# EAGLE design flyback (EAGLE 9.6.2)
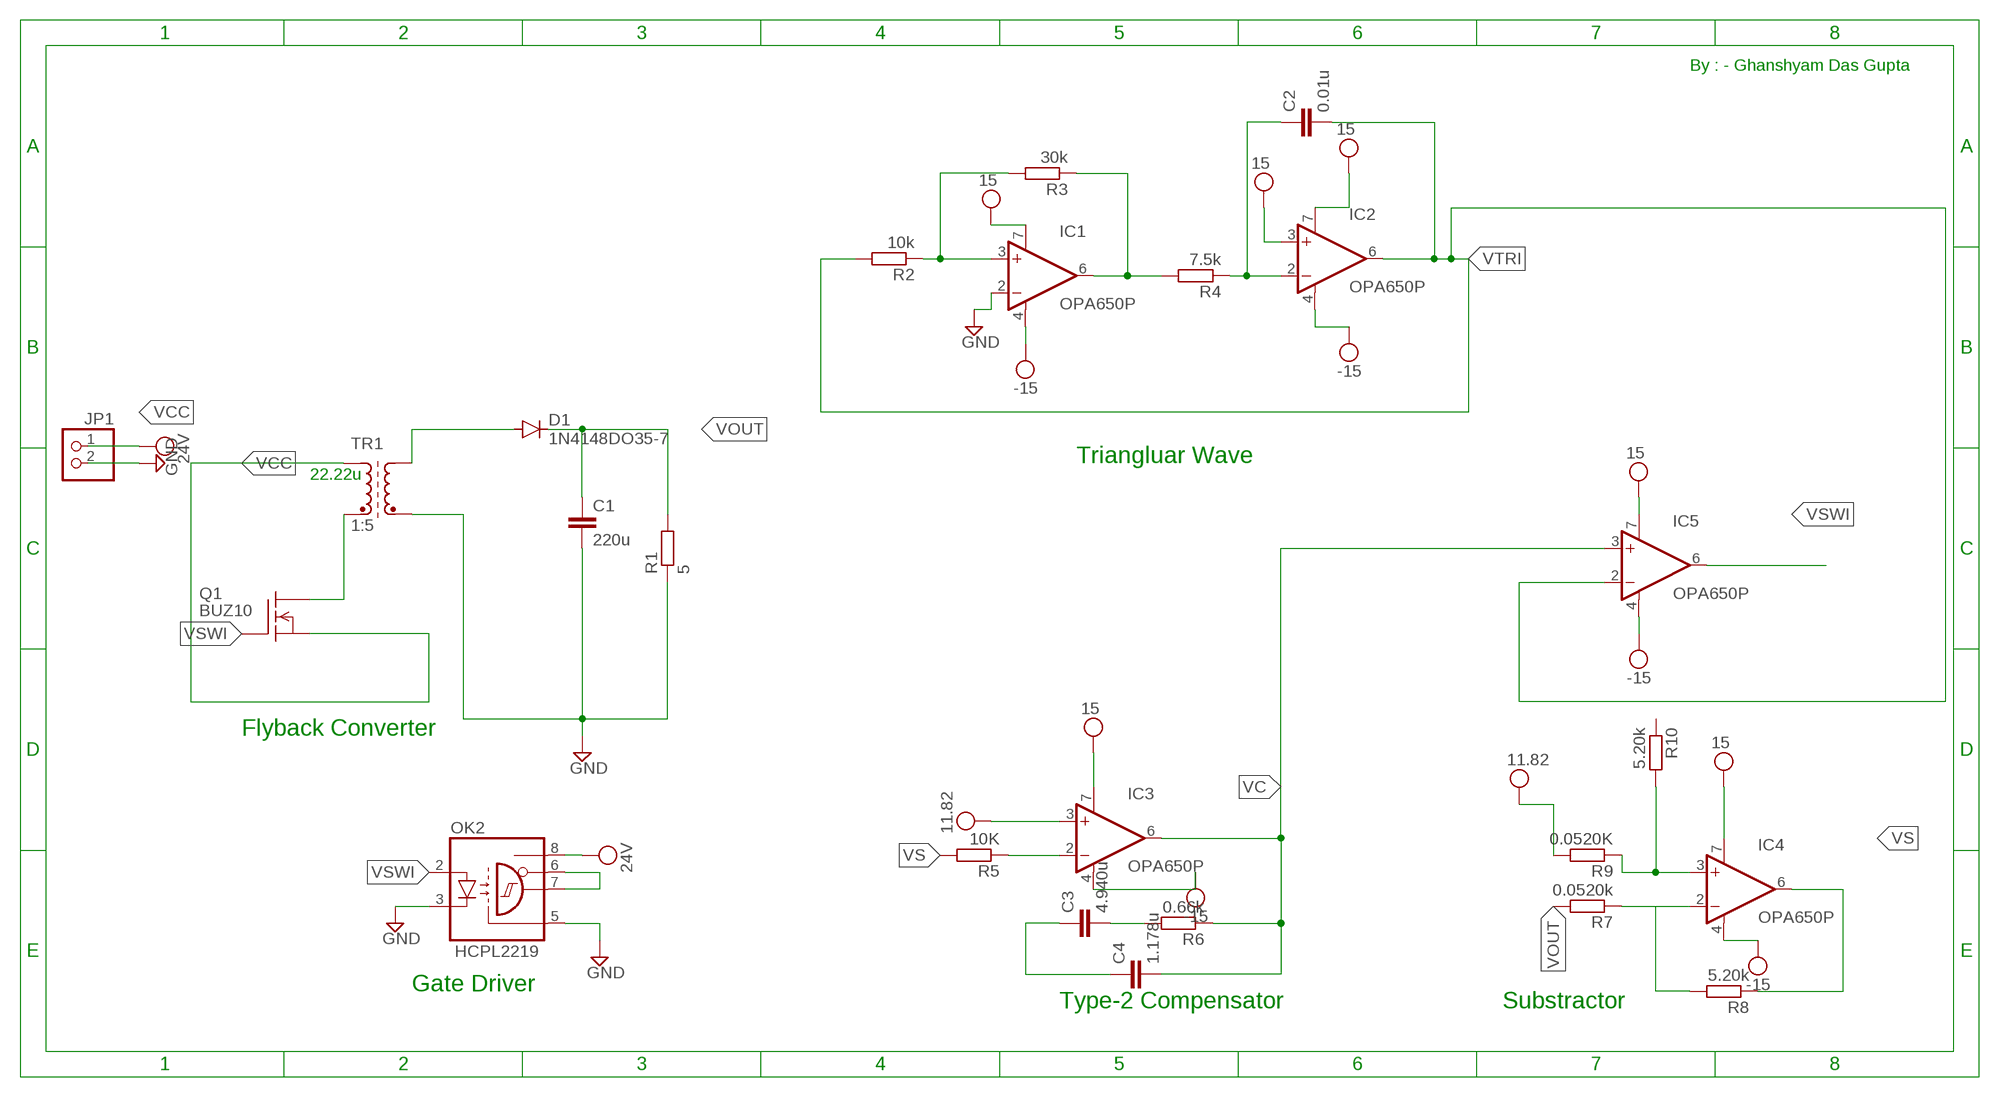
[diagram p0: schematic, sheet 1]

## Parts
C1  220u  C-EU050-050X075  [C050-050X075]
C2  0.01u  C-EU050-050X075  [C050-050X075]
C3  4.940u  C-EU050-050X075  [C050-050X075]
C4  1.178u  C-EU050-050X075  [C050-050X075]
D1  1N4148DO35-7  [DO35-7]
IC1  OPA650P  [DIL08]
IC2  OPA650P  [DIL08]
IC3  OPA650P  [DIL08]
IC4  OPA650P  [DIL08]
IC5  OPA650P  [DIL08]
JP1  PINHD-1X2  [1X02]
OK2  HCPL2219  [DIL08]
Q1  BUZ10  [TO220]
R1  5  R-EU_0414/15  [0414/15]
R2  10k  R-EU_0414/15  [0414/15]
R3  30k  R-EU_0414/15  [0414/15]
R4  7.5k  R-EU_0414/15  [0414/15]
R5  10K  R-EU_0414/15  [0414/15]
R6  0.66k  R-EU_0414/15  [0414/15]
R7  0.0520k  R-EU_0414/15  [0414/15]
R8  5.20k  R-EU_0414/15  [0414/15]
R9  0.0520K  R-EU_0414/15  [0414/15]
R10  5.20k  R-EU_0414/15  [0414/15]
TR1  1:5  SM-T4  [SM-T4]

## Nets
GND: C1.2 IC1.2(-IN) JP1.2 OK2.3(C) OK2.5(GND) R1.1 TR1.4(E2)
N$1: Q1.3(S) TR1.1(A1)
N$2: D1.A TR1.5(A2)
N$3: IC1.3(+IN) R2.1 R3.2
N$4: OK2.6(VE) OK2.7(VO)
N$5: Q1.2(D) TR1.2(E1)
N$6: IC1.6(OUT) R3.1 R4.2
N$7: IC3.2(-IN) R5.1
N$8: C3.2 R6.2
N$9: C2.1 IC2.2(-IN) R4.1
N$12: C3.1 C4.1
N$13: IC4.3(+IN) R9.1 R10.2
N$14: IC4.2(-IN) R7.1 R8.2
VC: C4.2 IC3.6(OUT) IC5.3(+IN) R6.1
VCC: IC1.4(V-) IC1.7(V+) IC2.3(+IN) IC2.4(V-) IC2.7(V+) IC3.3(+IN) IC3.4(V-) IC3.7(V+) IC4.4(V-) IC4.7(V+) IC5.4(V-) IC5.7(V+) JP1.1 OK2.8(VCC) R9.2 ; supply symbol labelled 24V, 15, -15, 11.82
VOUT: C1.1 D1.C R1.2
VS: IC4.6(OUT) R8.1
VSWI: IC5.6(OUT)
VTRI: C2.2 IC2.6(OUT) IC5.2(-IN) R2.2
Unconnected: OK2.2(A) Q1.1(G) R5.2 R7.2 R10.1

## Notes on the sheet
- By : - Ghanshyam Das Gupta
- Triangluar Wave
- 22.22u
- Flyback Converter
- Gate Driver
- Type-2 Compensator | Substractor

## Library data of the parts
C1-C4 = rcl:C-EU: CAPACITOR, European symbol; SPICEPREFIX: C
D1 = diode:1N4148: DIODE high speed (Philips)
IC1-IC5 = burr-brown:OPA650: Operational Amplifier Wideband, Low Power, Voltage Feedback; OC_FARNELL: unknown; OC_NEWARK: unknown
JP1 = pinhead:PINHD-1X2: PIN HEADER
OK2 = optocoupler:HCPL2219: HEWLETT PACKARD OPTO COUPLER; MF: AGILENT TECHNOLOGIES; MPN: HCPL-2219-000E; OC_FARNELL: 9995250; OC_NEWARK: 31K6963
Q1 = transistor-fet:BUZ10: N-Channel Enhancement MOSFET 50V; 20A; 0,080Ohm
R1-R10 = rcl:R-EU_: RESISTOR, European symbol; SPICEPREFIX: R
TR1 = inductor-neosid:SM-T4: TRANSFORMER SMD wideband transformer; OC_FARNELL: unknown; OC_NEWARK: unknown

## Net classes
0 default: width 0.203 mm, drill 0.203 mm, clearance 0.203 mm
1 VCC: width 0.203 mm, drill 0.152 mm, clearance 0.152 mm
2 GND: width 1.219 mm, drill 0.152 mm, clearance 0.152 mm

## Board
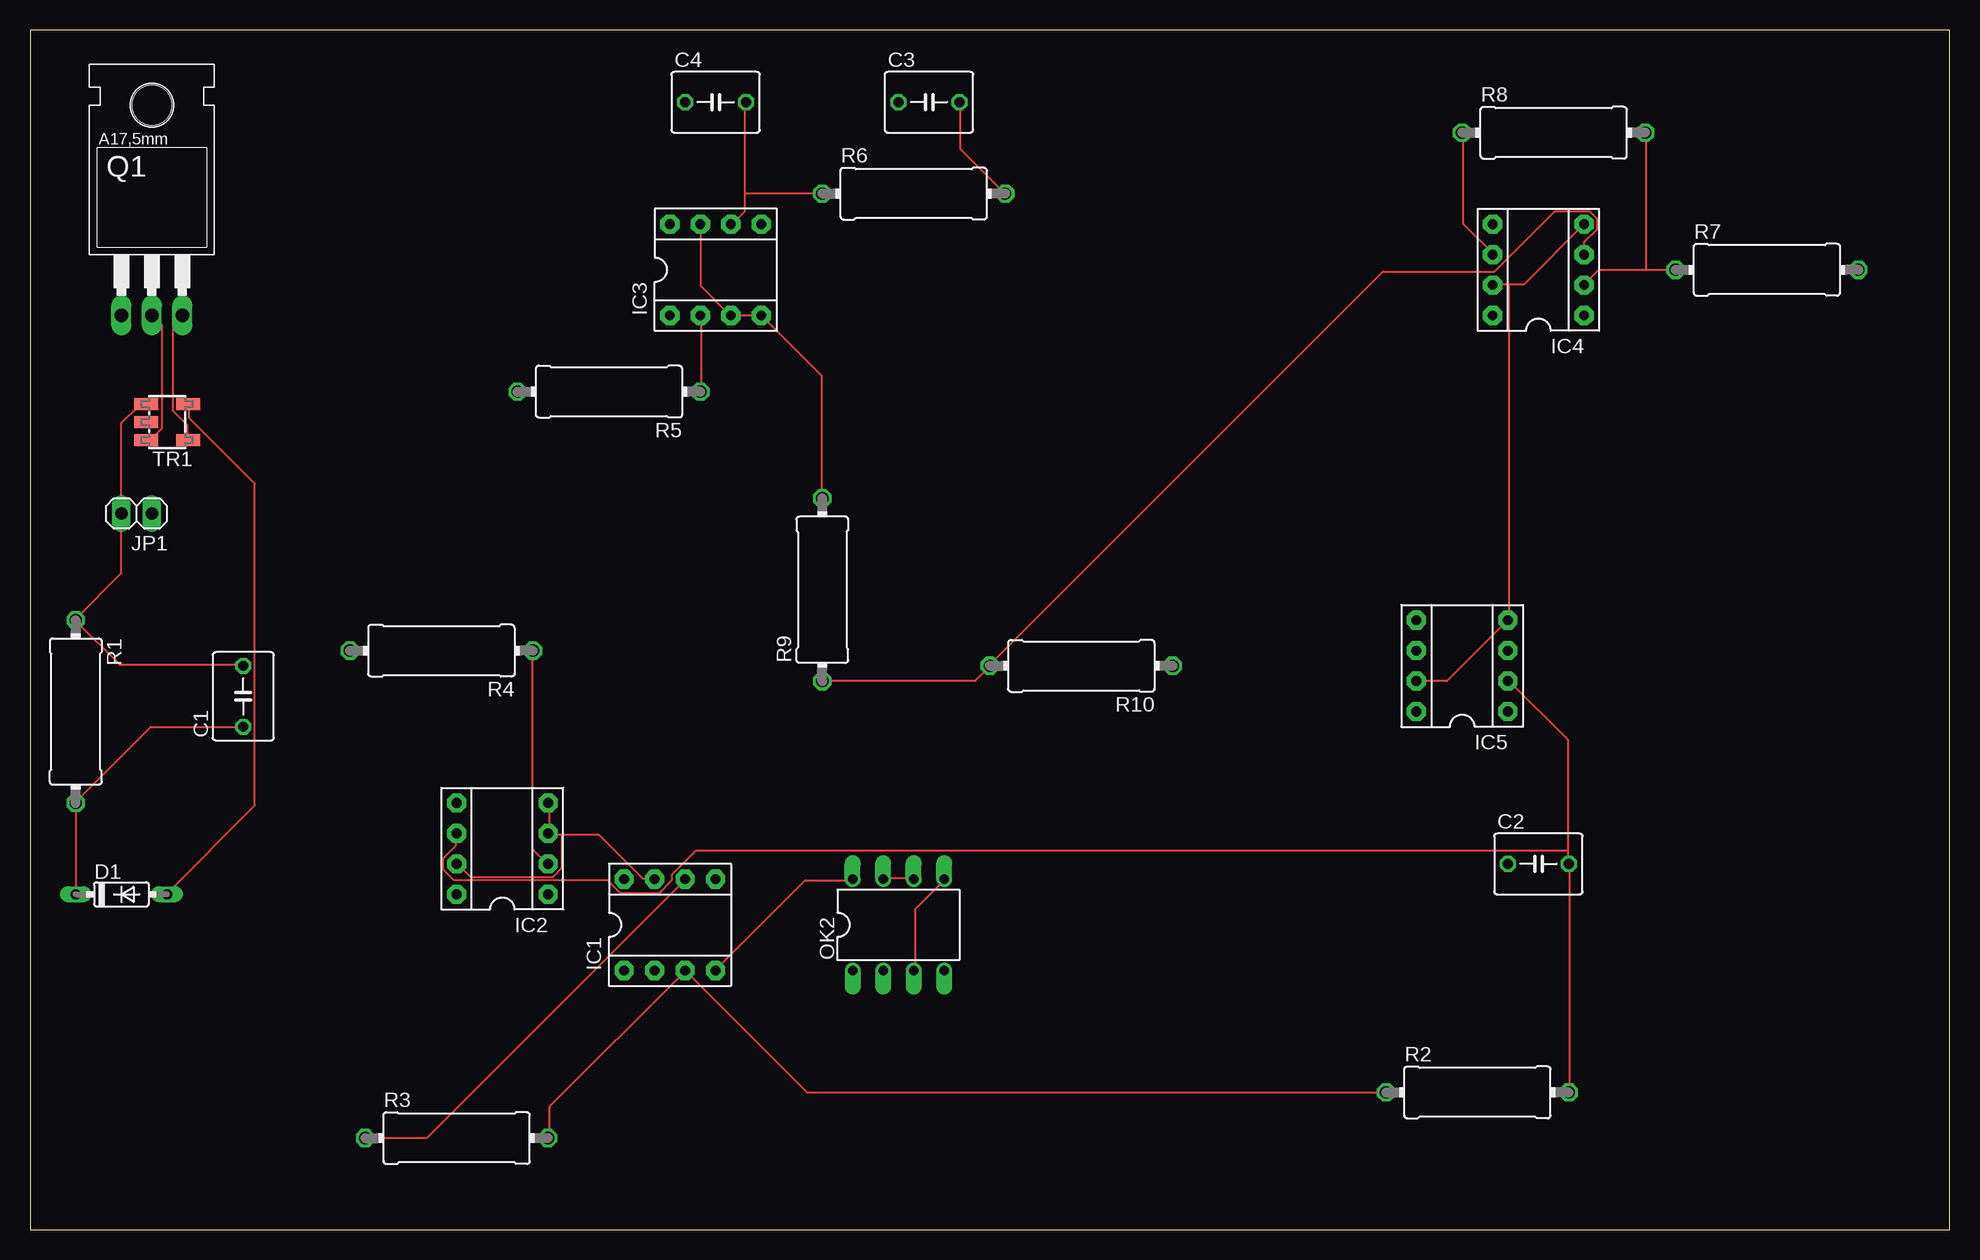
[diagram p1: board, top side]
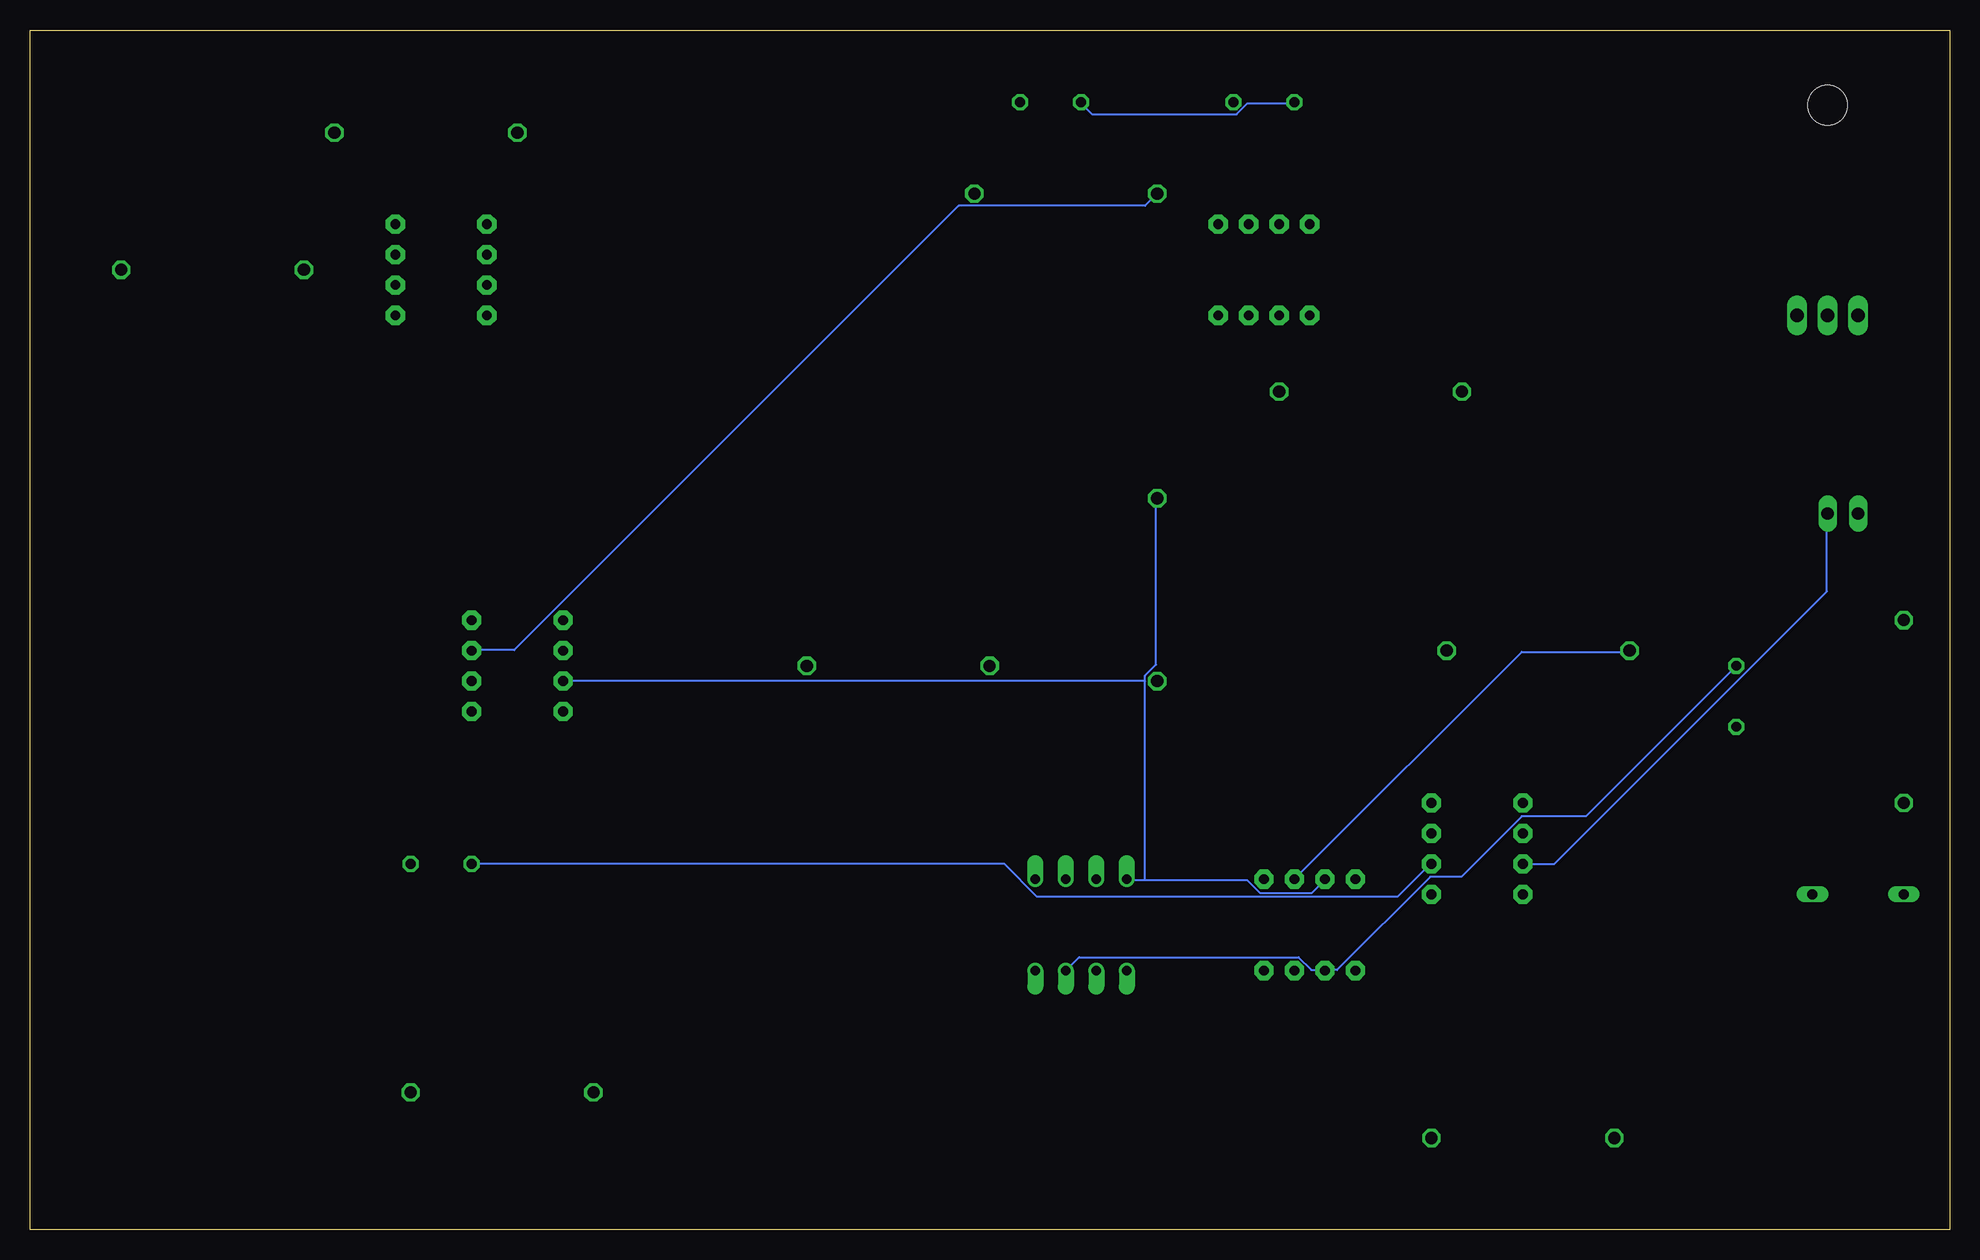
[diagram p2: board, bottom side, seen from below]

Size 160 x 100 mm. Coordinates in mm from the lower left corner, seen from the top.
Outline: 0,0 160,0 160,100 0,100 0,0
Copper layers (1*16): Top 0.035mm / dielectric 1.5mm / Bottom 0.035mm
Design rules "default": minimum track width 6mil, minimum drill 0.35mm, track to track 6mil, track to pad 6mil, pad to pad 6mil, via to via 6mil, smd to smd 6mil, copper to edge 40mil, drill to drill 6mil, minimum pad ring 10mil, minimum via ring 8mil, stop-mask expansion 4mil, vias tented up to drill 0mil, thermal gap 10mil

### Footprints (pad centres in the part's own frame; a part is rotated, then mirrored left to right if it is on the bottom)
C050-050X075 = drill 0.813 octagon: 1 -2.54,0; 2 2.54,0
DO35-7 = drill 0.813 long: A 3.81,0; C -3.81,0
DIL08 = drill 0.813 pad 1.6 octagon: 1 -3.81,-3.81; 2 -1.27,-3.81; 3 1.27,-3.81; 4 3.81,-3.81; 5 3.81,3.81; 6 1.27,3.81; 7 -1.27,3.81; 8 -3.81,3.81
1X02 = drill 1.016 long: 1 -1.27,0; 2 1.27,0
DIL08' = drill 0.813 offset: 1 -3.81,-3.81; 2 -1.27,-3.81; 3 1.27,-3.81; 4 3.81,-3.81; 5 3.81,3.81; 6 1.27,3.81; 7 -1.27,3.81; 8 -3.81,3.81
TO220 = drill 1.118 long: 1 -2.54,-6.35; 2 0,-6.35; 3 2.54,-6.35 | hole 3.302: 0,11.176
0414/15 = drill 1.016 octagon: 1 -7.62,0; 2 7.62,0
SM-T4 = smd 1 x 2: 1 -1.5,-1.75; 2 -1.5,1.75; 3 0,1.75; 4 1.5,1.75; 5 1.5,-1.75

### Placement (x,y rotation side)
C1  17.78,44.45 90 top
C2  125.73,30.48 0 top
C3  74.93,93.98 0 top
C4  57.15,93.98 0 top
D1  7.62,27.94 0 top
IC1  53.34,25.4 0 top
IC2  39.37,31.75 90 top
IC3  57.15,80.01 0 top
IC4  125.73,80.01 90 top
IC5  119.38,46.99 90 top
JP1  8.89,59.69 180 top
OK2  HCPL2219  [DIL08']  72.39,25.4 0 top
Q1  10.16,82.55 0 top
R1  3.81,43.18 270 top
R2  120.65,11.43 0 top
R3  35.56,7.62 0 top
R4  34.29,48.26 180 top
R5  48.26,69.85 180 top
R6  73.66,86.36 0 top
R7  144.78,80.01 0 top
R8  127,91.44 0 top
R9  66.04,53.34 90 top
R10  87.63,46.99 180 top
TR1  11.43,67.31 90 top

### Tracks (layer width: path | path; a pad name or v marks a point on that pad's centre or on a via)
GND
  Top 0.152: OK2.3 73.76,21.64 73.76,26.67 76.2,29.11 OK2.5 | TR1.4 9.6,68.73 9.14,68.73 7.62,67.21 JP1.2 7.62,54.71 3.81,50.9 R1.1 3.81,50.75 7.47,47.09 17.68,47.09 C1.2
  Bottom 0.152: OK2.3 72.54,22.71 54.25,22.71 53.19,21.64 52.12,21.64 IC1.2 51.97,21.64 51.05,21.64 43.28,29.41 40.69,29.41 35.66,34.44 30.33,34.44 C1.2
N$1
  Top 0.152: TR1.1 13.11,65.84 13.11,67.06 11.89,68.28 11.89,75.44 12.65,76.2 Q1.3
N$2
  Top 0.152: TR1.5 13.26,68.73 13.26,67.67 18.75,62.18 18.75,35.36 11.43,28.04 D1.A
N$3
  Top 0.152: R3.2 43.28,7.62 43.28,10.21 54.56,21.49 IC1.3 64.77,11.43 R2.1
N$4
  Top 0.152: OK2.7 71.17,29.26 73.61,29.26 OK2.6
N$5
  Top 0.152: TR1.2 9.75,65.84 10.06,65.84 10.97,66.75 10.97,75.44 10.21,76.2 Q1.2
N$6
  Top 0.152: R3.1 33.07,7.62 54.56,29.11 IC1.6
  Bottom 0.152: IC1.6 35.66,48.16 26.67,48.16 R4.2
N$7
  Top 0.152: R5.1 55.93,69.95 55.93,76.2 IC3.2
N$8
  Top 0.152: R6.2 77.57,90.07 77.57,93.88 C3.2
N$9
  Top 0.152: R4.1 41.91,31.7 43.13,30.48 IC2.2
  Bottom 0.152: C2.1 78.79,30.48 76.05,27.74 46.02,27.74 43.28,30.48 IC2.2
N$12
  Bottom 0.152: C4.1 54.71,93.88 58.52,93.88 59.44,92.96 71.48,92.96 72.39,93.88 C3.1
N$13
  Top 0.152: R9.1 78.79,45.72 80.01,46.94 R10.2 80.01,47.09 112.78,79.86 122.07,79.86 127.1,84.89 130,84.89 130.61,84.28 130.61,83.36 129.54,82.3 IC4.3
N$14
  Top 0.152: 134.72,80.01 130.76,80.01 129.54,78.79 IC4.2 | 134.72,80.01 R7.1 | 134.72,80.01 134.72,91.44 R8.2
VC
  Top 0.152: 59.59,86.41 59.59,84.89 58.52,83.82 IC3.6 | 59.59,86.41 59.59,93.88 C4.2 | 59.59,86.41 65.99,86.41 R6.1
  Bottom 0.152: R6.1 67.06,85.34 82.6,85.34 119.63,48.31 123.14,48.31 IC5.3
VCC
  Top 0.152: IC5.7 118.11,45.72 IC5.4 123.29,50.9 123.29,78.79 | 123.29,78.79 124.51,78.79 IC4.4 | 123.29,78.79 121.92,78.79 IC4.7 | R9.2 65.99,60.96 65.99,71.17 IC3.4 IC3.3 58.37,76.2 55.93,78.64 55.93,83.82 IC3.7 | OK2.8 68.58,29.11 64.62,29.11 57.15,21.64 IC1.4 | IC2.4 43.28,35.51 43.28,33.07 IC2.3 43.28,32.92 44.35,32.92 | 44.35,32.92 47.4,32.92 51.05,29.26 51.97,29.26 IC1.7 | 44.35,32.92 44.35,30.18 43.59,29.41 36.73,29.41 35.66,30.48 IC2.7
  Bottom 0.152: IC2.7 32.92,30.48 10.21,53.19 10.21,59.59 JP1.1 | 67.06,29.11 58.52,29.11 57.45,28.04 53.19,28.04 52.12,29.11 IC1.7 | 67.06,29.11 68.58,29.11 OK2.8 | 67.06,29.11 67.06,45.72 | 67.06,45.72 67.06,46.18 66.14,47.09 66.14,60.96 R9.2 | 67.06,45.72 IC5.7
VOUT
  Top 0.152: D1.C R1.2 3.81,35.66 10.06,41.91 C1.1
VS
  Top 0.152: R8.1 119.48,91.44 119.48,83.82 121.92,81.38 IC4.6
VTRI
  Top 0.152: 128.17,31.55 128.17,40.84 123.29,45.72 IC5.2 | 128.17,31.55 128.17,30.48 C2.2 128.32,30.48 128.32,11.43 R2.2 | 128.17,31.55 55.47,31.55 53.49,29.57 53.49,29.11 52.43,28.04 49.23,28.04 48.16,29.11 35.36,29.11 34.44,30.02 34.44,30.94 35.51,32 35.51,32.92 IC2.6